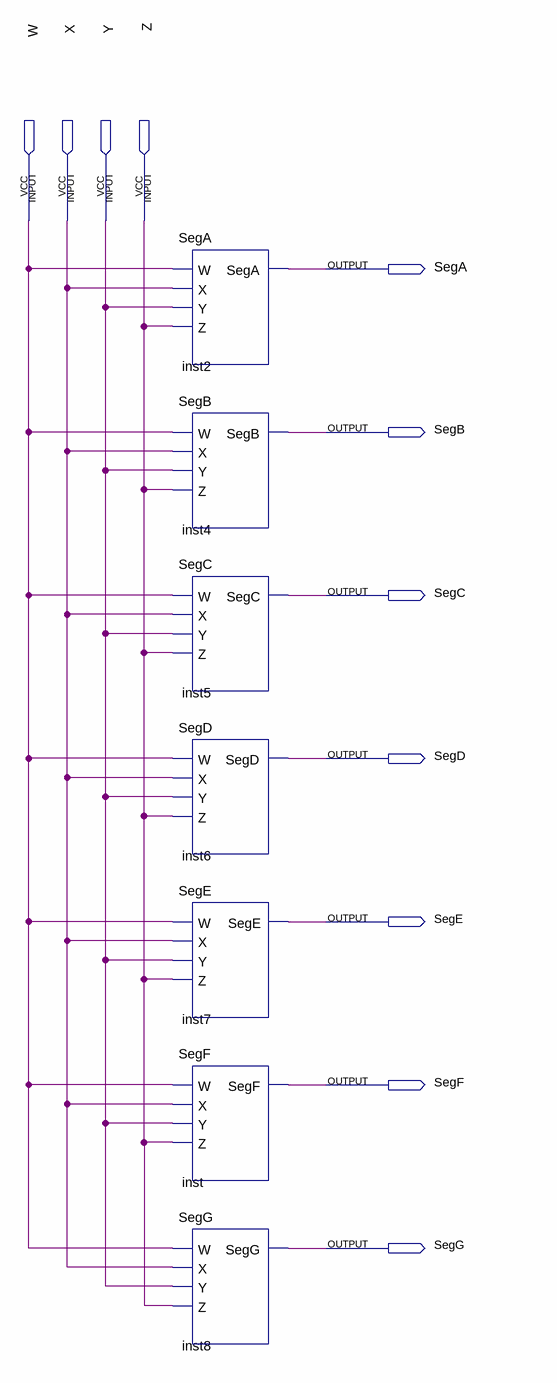
[diagram p0: schematic sheet]
// Quartus schematic HexToSSD.bdf as structural Verilog: 7 symbols, 11 pins
module HexToSSD (
  input  W,
  input  X,
  input  Y,
  input  Z,
  output SegA,
  output SegB,
  output SegC,
  output SegD,
  output SegE,
  output SegF,
  output SegG
);

  SegA inst2 (.W(W), .X(X), .Y(Y), .Z(Z), .SegA(SegA));
  SegB inst4 (.W(W), .X(X), .Y(Y), .Z(Z), .SegB(SegB));
  SegC inst5 (.W(W), .X(X), .Y(Y), .Z(Z), .SegC(SegC));
  SegD inst6 (.W(W), .X(X), .Y(Y), .Z(Z), .SegD(SegD));
  SegE inst7 (.W(W), .X(X), .Y(Y), .Z(Z), .SegE(SegE));
  SegF inst (.W(W), .X(X), .Y(Y), .Z(Z), .SegF(SegF));
  SegG inst8 (.W(W), .X(X), .Y(Y), .Z(Z), .SegG(SegG));
endmodule
